# Altium schematic sheet Main.SchDoc: 2.4 GHz power detector with amplification
size A4; Author: Eng. Mateusz Maciejuk; Revision: 2
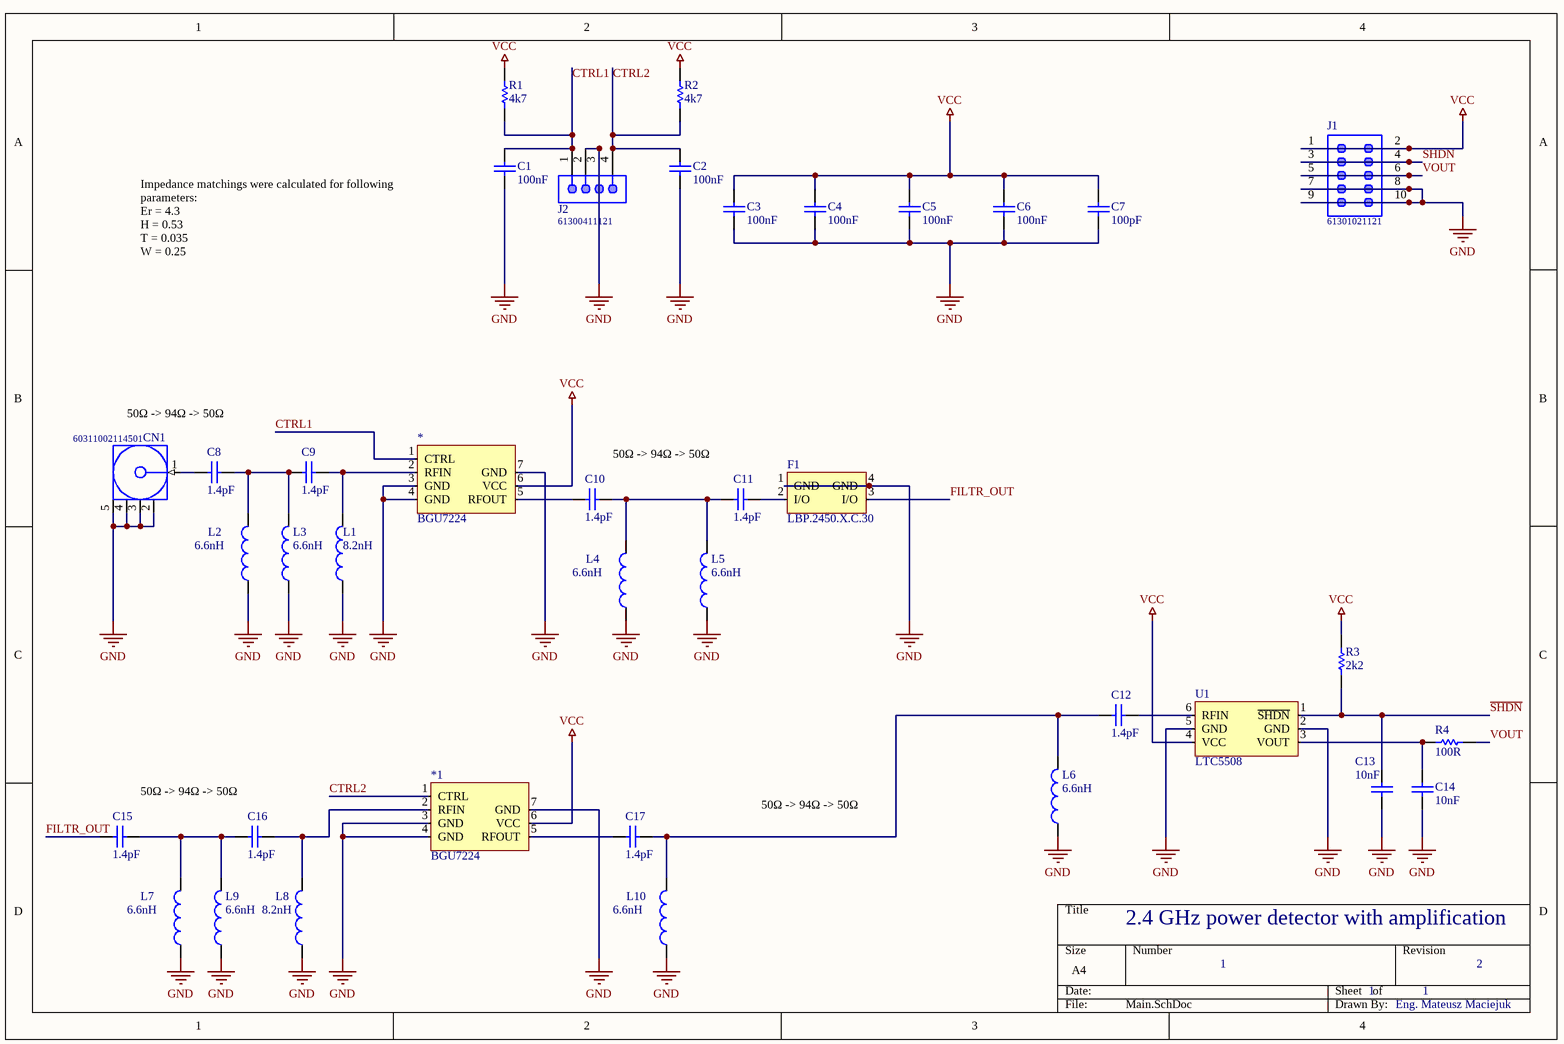
[diagram p0: Main.SchDoc]

## Parts
*  BGU7224  [SON50P160X50_HS-7M]
*1  BGU7224  [SON50P160X50_HS-7M]
C1  100nF  [CAPC0402(1005)60_M]
C2  100nF  [CAPC0402(1005)60_M]
C3  100nF  [CAPC0402(1005)60_M]
C4  100nF  [CAPC0402(1005)60_M]
C5  100nF  [CAPC0402(1005)60_M]
C6  100nF  [CAPC0402(1005)60_M]
C7  100pF  [CAPC0402(1005)60_M]
C8  1.4pF  [CAPC0402(1005)60_M]
C9  1.4pF  [CAPC0402(1005)60_M]
C10  1.4pF  [CAPC0402(1005)60_M]
C11  1.4pF  [CAPC0402(1005)60_M]
C12  1.4pF  [CAPC0402(1005)60_M]
C13  10nF  [WCAP-CSGP_0603_Reflow]
C14  10nF  [WCAP-CSGP_0603_Reflow]
C15  1.4pF  [CAPC0402(1005)60_M]
C16  1.4pF  [CAPC0402(1005)60_M]
C17  1.4pF  [CAPC0402(1005)60_M]
CN1  60311002114501  [60311002114501]
F1  LBP.2450.X.C.30  [LBP.2450.X.C.30]
J1  61301021121  [61301021121]
J2  61300411121  [61300411121]
L1  8.2nH  [INDC1006X60X20LL10T10]
L2  6.6nH  [INDC1006X60X20LL10T10]
L3  6.6nH  [INDC1006X60X20LL10T10]
L4  6.6nH  [INDC1006X60X20LL10T10]
L5  6.6nH  [INDC1006X60X20LL10T10]
L6  6.6nH  [INDC1006X60X20LL10T10]
L7  6.6nH  [INDC1006X60X20LL10T10]
L8  8.2nH  [INDC1006X60X20LL10T10]
L9  6.6nH  [INDC1006X60X20LL10T10]
L10  6.6nH  [INDC1006X60X20LL10T10]
R1  4k7  [RESC1005X40X25ML05T05]
R2  4k7  [RESC1005X40X25ML05T05]
R3  2k2  [RESC1005X40X25ML05T05]
R4  100R  [RESC1005X40X25ML05T05]
U1  LTC5508  [SOT65P210X100-6N]

## Nets
GND: *.3(GND) *.4(GND) *.7(GND) *1.3(GND) *1.4(GND) *1.7(GND) C1.1 C2.1 C3.2 C4.2 C5.2 C6.2 C7.2 C13.1 C14.1 CN1.2(GND) CN1.3(GND) CN1.4(GND) CN1.5(GND) F1.1(GND) F1.4(GND) J1.7 J1.8 J1.9 J1.10 J2.2 J2.3 L1.1 L2.1 L3.1 L4.1 L5.1 L6.1 L7.1 L8.1 L9.1 L10.1 U1.2(GND) U1.5(GND)
VCC: *.6(VCC) *1.6(VCC) C3.1 C4.1 C5.1 C6.1 C7.1 J1.1 J1.2 R1.2 R2.2 R3.2 U1.4(VCC)
CTRL1: *.1(CTRL) C1.2 J2.1 R1.1
CTRL2: *1.1(CTRL) C2.2 J2.4 R2.1
FILTR_OUT: C15.1 F1.3(I/O)
~{SHDN}: C13.2 J1.3 J1.4 R3.1 U1.1(~{SHDN})
VOUT: J1.5 J1.6 R4.1
Net*1_2: *1.2(RFIN) C16.1 L8.2
Net*1_5: *1.5(RFOUT) C17.1
Net*_2: *.2(RFIN) C9.1 L1.2
Net*_5: *.5(RFOUT) C10.1
NetC8_1: C8.1 CN1.1(Signal)
NetC8_2: C8.2 C9.2 L2.2 L3.2
NetC10_2: C10.2 C11.2 L4.2 L5.2
NetC11_1: C11.1 F1.2(I/O)
NetC12_1: C12.1 U1.6(RFIN)
NetC12_2: C12.2 C17.2 L6.2 L10.2
NetC14_2: C14.2 R4.2 U1.3(VOUT)
NetC15_2: C15.2 C16.2 L7.2 L9.2

## Notes on the sheet
- Impedance matchings were calculated for following parameters:
  Er = 4.3
  H = 0.53
  T = 0.035
  W = 0.25
- 50Ω -> 94Ω -> 50Ω
- 1
- Title
- Size:
- Date:
- A4
- Number:
- Time:
- Revision:
- Sheet
- of
- File:

## Library data of the parts
C1-C12 C15-C17 = CMP-1034-02078-1: CAP 100nF 50V ±20% 0402 (1005 Metric) Thickness 0.6mm SMD; Case-Metric: 1005; Tolerance: Â±20%; Case-EIA: 0402; Value: 100nF; Rated Voltage: 50 V; Technology: SMT; Max Thickness: 0.6 mm
C13 C14 = 885012206020: WCAP-CSGP General Purpose Ceramic Capacitors, size 0603, 100nF, +/-10%, 10VDC; Isolation Resistance: >=5GOhm; Ceramic Type: X7R; Technical Reference: X7R0603104K010DFCT10000; ComponentLink1Description: Manufacturer; ComponentLink1URL: http://www.we-online.de; ComponentLink2Description: Datasheet; ComponentLink2URL: https://katalog.we-online.com/pbs/datasheet/885012206020.pdf; Operating Temperature: -55 to +125degC; Packaging: Tape and Reel; Part Number: 885012206020; Publisher: Wurth Elektronik; Rated Voltage: 10VDC; Published Date: August 2019; Capacitance Tolerance: +/-10%; Dissipation Factor: =<5%; Height: 0.8mm +/-0.07mm; Mounting Technology: SMD; Size: 0603; Capacitance: 100nF
CN1 = 60311002114501: WR-SMA PCB Jack, THT, Right Angle; Impedance: 50Ohm; Connector Type: SMA; Frequency Range: DC~18GHz; Interface: MIL-STD-348; Center Contact Diameter: 1.27mm; ComponentLink1Description: Manufacturer; ComponentLink1URL: http://www.we-online.de; ComponentLink2Description: Datasheet; ComponentLink2URL: https://katalog.we-online.com/em/datasheet/60311002114501.pdf; Part Number: 60311002114501; Published Date: May 2019; Publisher: Wurth Elektronik; Operating Temperature: -65 to +165degC; Gender: Jack; Packaging: Tray; Mounting Technology: THT; Orientation Type: Right Angle
J1 = 61301021121: WR-PHD Pin Header, THT, pitch 2.54mm, Dual Row, Vertical, 10pin; Pin Number: 10; Gender: Male; Rated Current: 3A; Working Voltage: 250VAC; Withstanding Voltage: 500VAC; Contact Resistance: 20mOhm; ComponentLink1Description: Manufacturer; ComponentLink1URL: http://www.we-online.de; ComponentLink2Description: Datasheet; ComponentLink2URL: https://katalog.we-online.de/em/datasheet/6130xx21121.pdf; Part Number: 61301021121; Published Date: June 2019; Publisher: Wurth Elektronik; Pitch: 2.54mm; Operating Temperature: -40 to +105degC; Mounting Technology: THT; Packaging: Bag; Row Number: Dual; Orientation: Vertical
J2 = 61300411121: WR-PHD Pin Header, THT, pitch 2.54mm, Single Row, Vertical, 4pin; Pin Number: 4; Gender: Male; Rated Current: 3A; Working Voltage: 250VAC; Withstanding Voltage: 500VAC; Contact Resistance: 20mOhm; ComponentLink1Description: Manufacturer; ComponentLink1URL: http://www.we-online.de; ComponentLink2Description: Datasheet; ComponentLink2URL: https://katalog.we-online.de/em/datasheet/6130xx11121.pdf; Part Number: 61300411121; Published Date: June 2019; Publisher: Wurth Elektronik; Pitch: 2.54mm; Operating Temperature: -40 to +105degC; Mounting Technology: THT; Packaging: Bag; Row Number: Single; Orientation: Vertical
L1 L8 = CMP-2000-06594-1: Chip Inductor, 8.2 nH, +/- 5%, 500 mA, -55 to 125 degC, 0402 (1005 Metric), RoHS, Tape and Reel; Manufacturer: Murata; Inductance-Nom: 10nH; Type: Molded; DC Resistance: 0.17O; Rated Current-Max: 500mA; Manufacturer URL: http://www.murata.com/; Tolerance (%): ±5%; Datasheet Version: 09/2012; Package Reference: 0402; Package Description: 2-Pin Surface Mount Device, Body 1 x 0.6 mm; Mounting Technology: SurfaceMount; Case Size/Dimension: 0402; Datasheet URL: http://search.murata.co.jp/Ceramy/image/img/PDF/ENG/L0075S0080LQW15A_00.pdf
L2-L7 L9 L10 = CMP-2000-06594-1: Chip Inductor, 6.6 nH, +/- 5%, 500 mA, -55 to 125 degC, 0402 (1005 Metric), RoHS, Tape and Reel; Manufacturer: Murata; Inductance-Nom: 10nH; Type: Molded; DC Resistance: 0.17O; Rated Current-Max: 500mA; Manufacturer URL: http://www.murata.com/; Tolerance (%): ±5%; Datasheet Version: 09/2012; Package Reference: 0402; Package Description: 2-Pin Surface Mount Device, Body 1 x 0.6 mm; Mounting Technology: SurfaceMount; Case Size/Dimension: 0402; Datasheet URL: http://search.murata.co.jp/Ceramy/image/img/PDF/ENG/L0075S0080LQW15A_00.pdf
R1-R4 = CMP-2002-08452-1: Part Number: CRCW04022K20FKED; Manufacturer: Vishay Dale